# EAGLE design HealthMonitor (EAGLE 9.5.0)
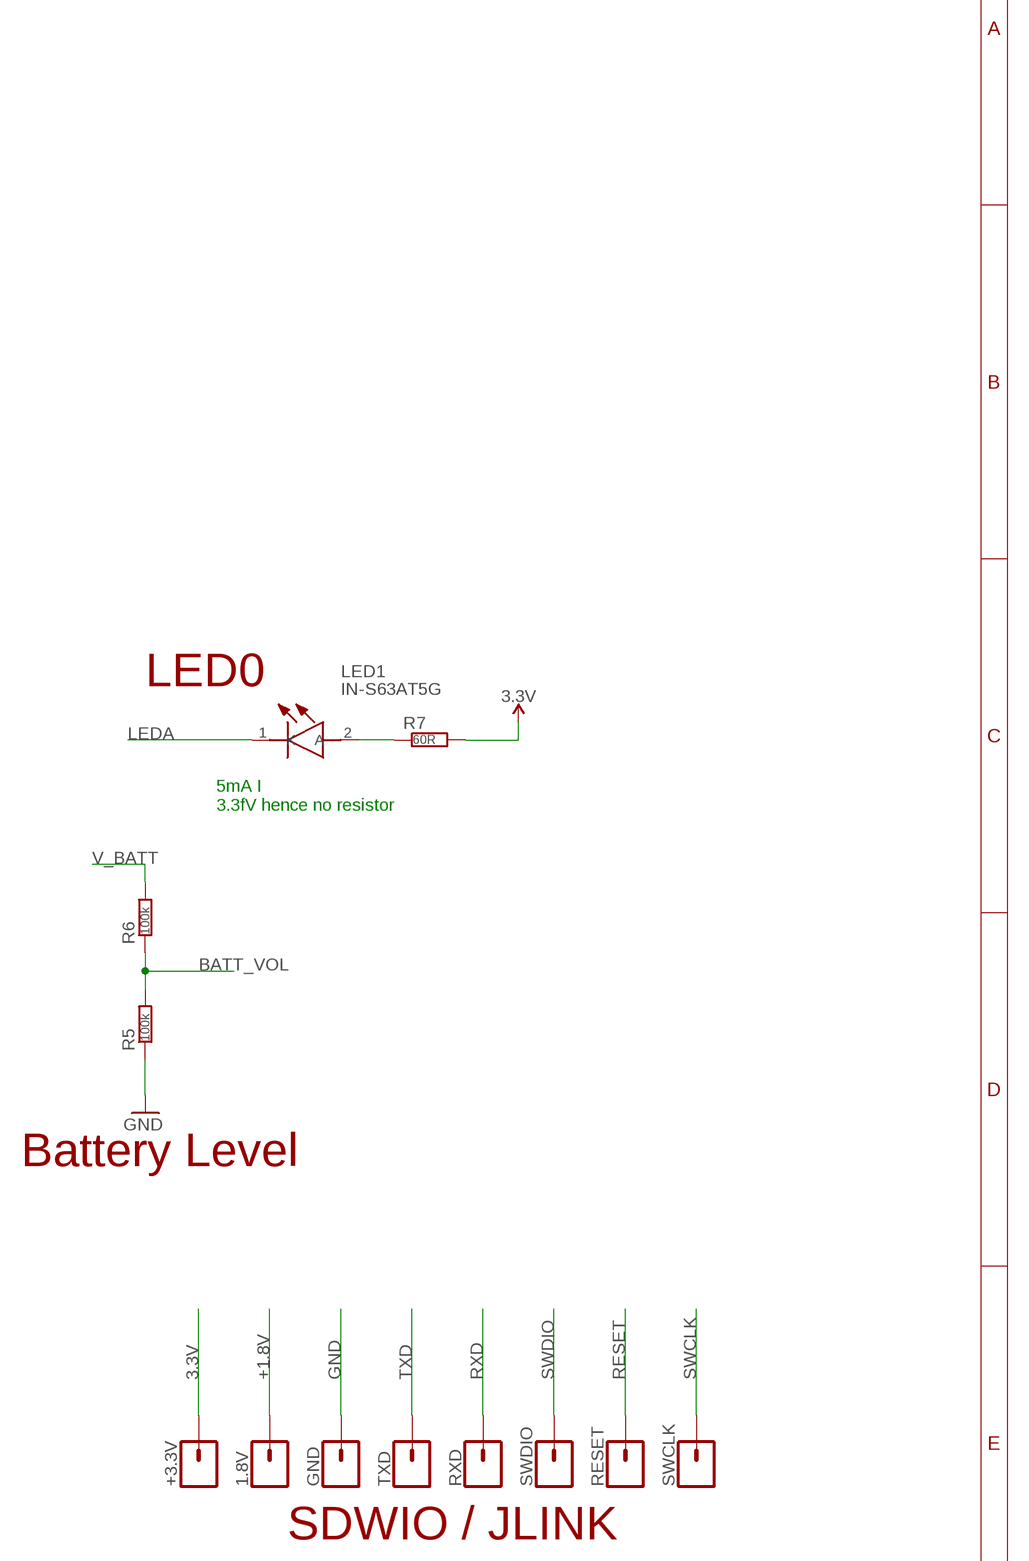
[diagram p0: schematic, sheet 1, part 1 of 2]
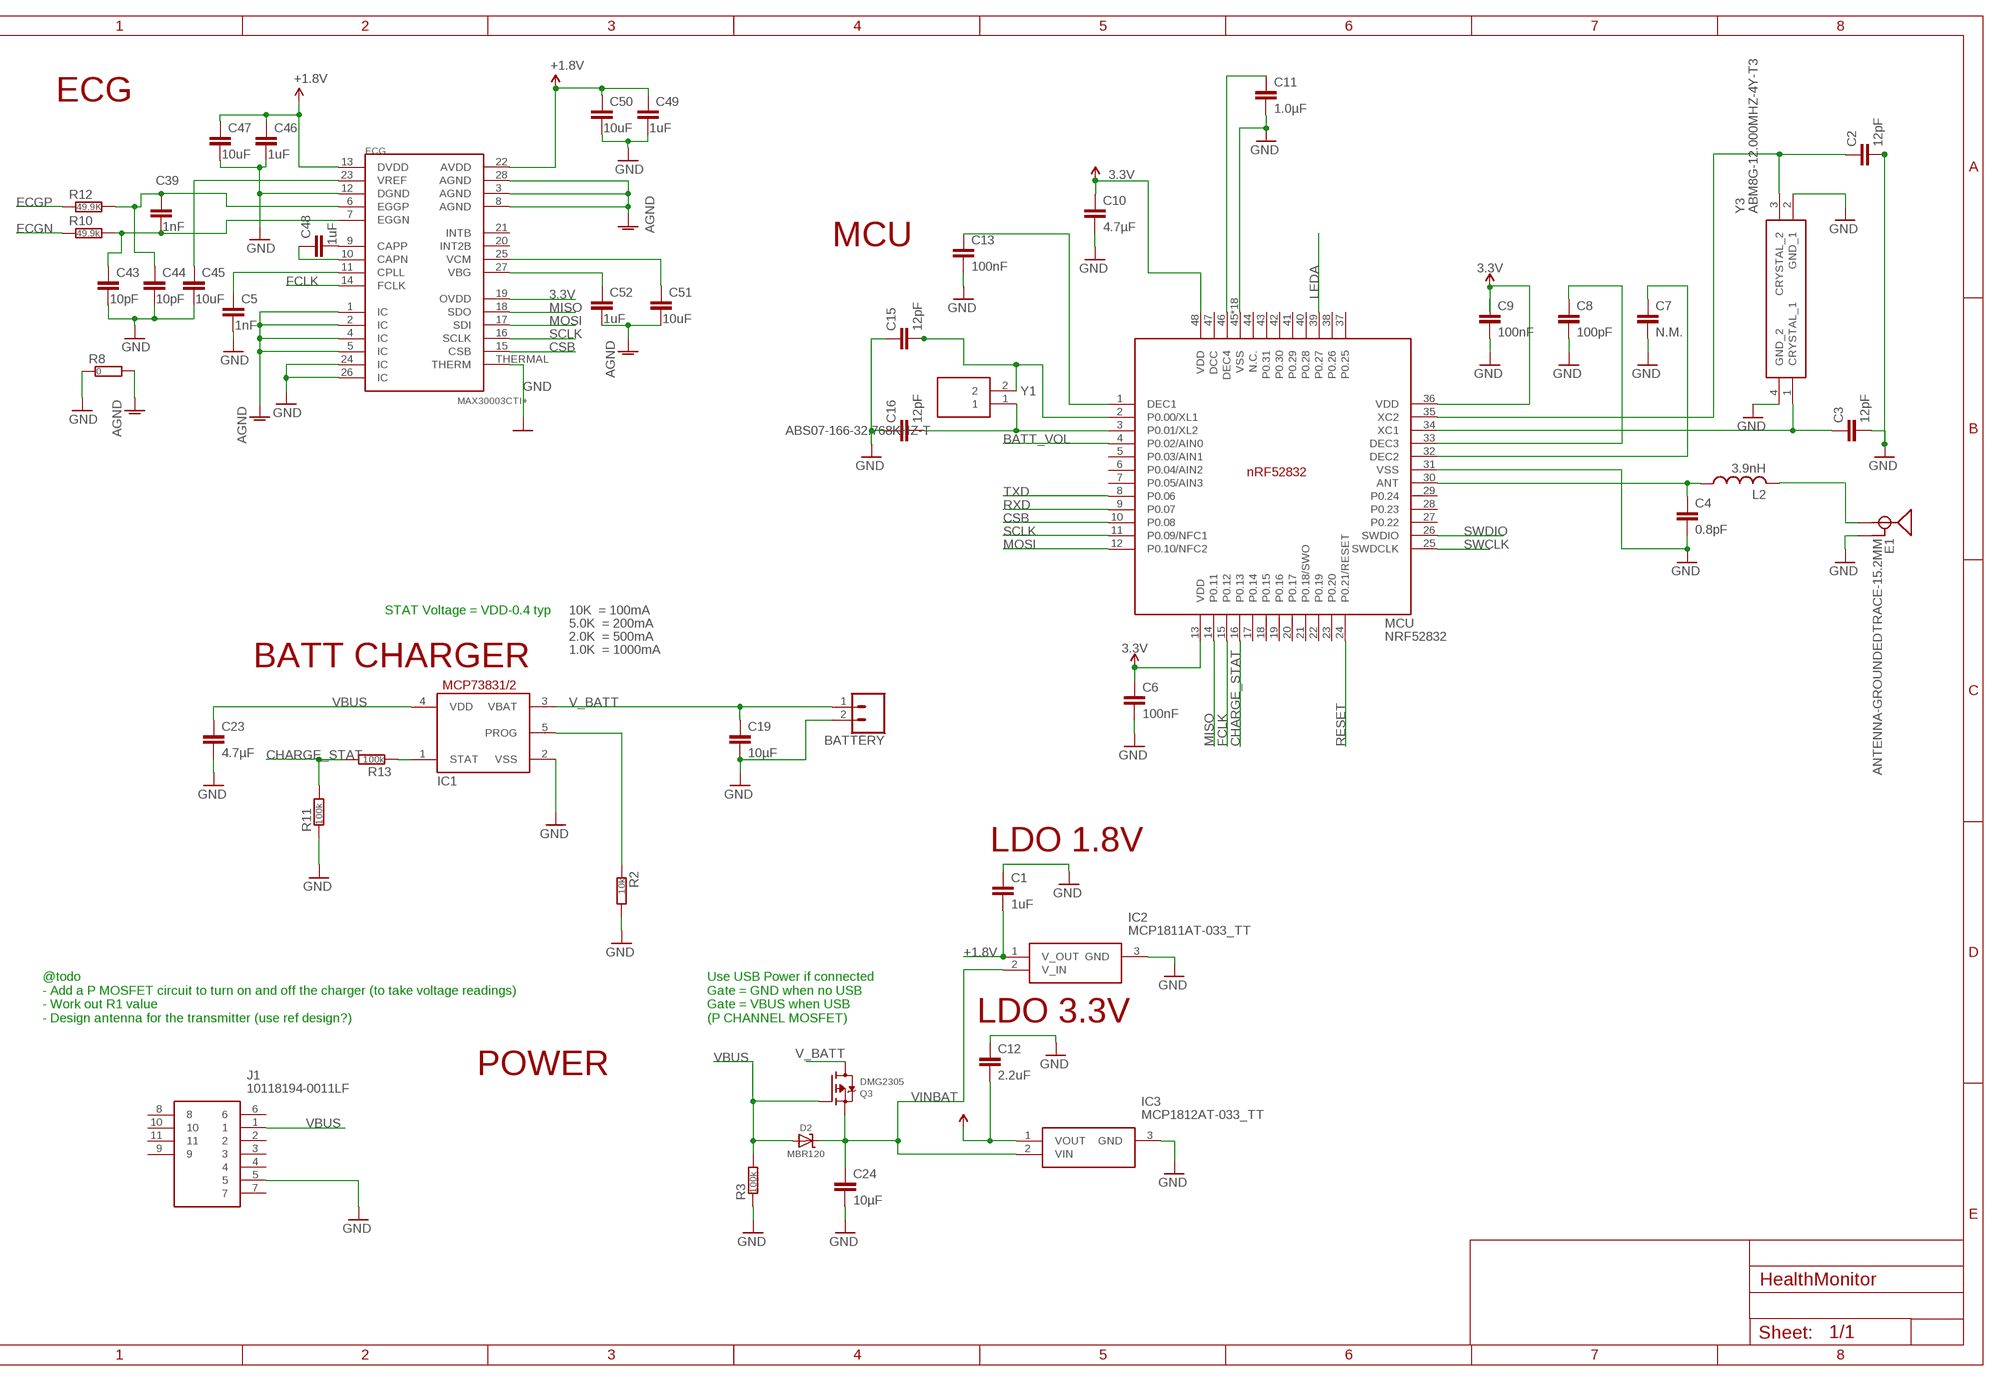
[diagram p1: schematic, sheet 1, part 2 of 2]

## Parts
1.8V  CONN_01  [1X01]
+3.3V  CONN_01  [1X01]
BATTERY  CONN_02  [1X02]
C1  1uF  CAPACITOR_0603_N  [RESC0603_N]
C2  12pF  CAPACITOR_0603_N  [RESC0603_N]
C3  12pF  CAPACITOR_0603_N  [RESC0603_N]
C4  0.8pF  CAPACITOR_0603_N  [RESC0603_N]
C5  1nF  CAPACITOR_0603_N  [RESC0603_N]
C6  100nF  CAPACITOR_0603_N  [RESC0603_N]
C7  N.M.  CAPACITOR_0603_N  [RESC0603_N]
C8  100pF  CAPACITOR_0603_N  [RESC0603_N]
C9  100nF  CAPACITOR_0603_N  [RESC0603_N]
C10  4.7µF  CAPACITOR_0603_N  [RESC0603_N]
C11  1.0µF  CAPACITOR_0603_N  [RESC0603_N]
C12  2.2uF  CAPACITOR_0603_N  [RESC0603_N]
C13  100nF  CAPACITOR_0603_N  [RESC0603_N]
C15  12pF  CAPACITOR_0603_N  [RESC0603_N]
C16  12pF  CAPACITOR_0603_N  [RESC0603_N]
C19  10µF  CAPACITOR_0603_N  [RESC0603_N]
C23  4.7µF  CAPACITOR_0603_N  [RESC0603_N]
C24  10µF  CAPACITOR_0603_N  [RESC0603_N]
C39  1nF  CAPACITOR_0603_N  [RESC0603_N]
C43  10pF  CAPACITOR_0603_N  [RESC0603_N]
C44  10pF  CAPACITOR_0603_N  [RESC0603_N]
C45  10uF  CAPACITOR_0603_N  [RESC0603_N]
C46  1uF  CAPACITOR_0603_N  [RESC0603_N]
C47  10uF  CAPACITOR_0603_N  [RESC0603_N]
C48  1uF  CAPACITOR_0603_N  [RESC0603_N]
C49  1uF  CAPACITOR_0603_N  [RESC0603_N]
C50  10uF  CAPACITOR_0603_N  [RESC0603_N]
C51  10uF  CAPACITOR_0603_N  [RESC0603_N]
C52  1uF  CAPACITOR_0603_N  [RESC0603_N]
D2  MBR120  DIODE-SCHOTTKYSOD-123  [SOD-123]
E1  ANTENNA-GROUNDEDTRACE-15.2MM  [TRACE_ANTENNA_2.4GHZ_15.2MM]
ECG  MAX30003CTI+  MAX30003  [QFN-28]
GND  CONN_01  [1X01]
IC1  MCP73831/OT  [SOT23-5L]
IC2  MCP1811AT-033_TT  [SOT95P237X112-3N@1]
IC3  MCP1812AT-033_TT  [SOT95P237X112-3N]
J1  10118194-0011LF  [101181940011LF]
L2  3.9nH  INDUCTOR_0603_N  [RESC0603_N]
LED1  IN-S63AT5G  [LEDM168X39N]
MCU  NRF52832  [QFN40P600X600X90-48_N]
Q3  DMG2305  MOSFET-P  [SOT23-R]
R2  10k  RESISTOR_0603_N  [RESC0603_N]
R3  100k  RESISTOR_0603_N  [RESC0603_N]
R5  100k  RESISTOR_0603_N  [RESC0603_N]
R6  100k  RESISTOR_0603_N  [RESC0603_N]
R7  60R  RESISTOR_0603_N  [RESC0603_N]
R8  0  RESISTOR_0603_N  [RESC0603_N]
R10  49.9k  RESISTOR_0603_N  [RESC0603_N]
R11  100k  RESISTOR_0603_N  [RESC0603_N]
R12  49.9K  RESISTOR_0603_N  [RESC0603_N]
R13  100k  RESISTOR_0603_N  [RESC0603_N]
RESET  CONN_01  [1X01]
RXD  CONN_01  [1X01]
SWCLK  CONN_01  [1X01]
SWDIO  CONN_01  [1X01]
TXD  CONN_01  [1X01]
Y1  ABS07-166-32.768KHZ-T  [ABS0716632768KHZT]
Y3  ABM8G-12.000MHZ-4Y-T3  [ABM8G16000MHZB4YT]

## Nets
3.3V [power]: +3.3V.1 C6.1 C9.1 C10.1 C12.2 ECG.19(OVDD) IC3.1(VOUT) MCU.13(VDD) MCU.36(VDD) MCU.48(VDD) R7.2
+1.8V [power]: 1.8V.1 C1.2 C46.1 C47.1 C49.1 C50.1 ECG.13(DVDD) ECG.22(AVDD) IC2.1(V_OUT)
AGND: C51.2 C52.2 ECG.1(IC) ECG.2(IC) ECG.3(AGND) ECG.4(IC) ECG.5(IC) ECG.8(AGND) ECG.28(AGND) R8.2
BATT_VOL: MCU.4(P0.02/AIN0) R5.2 R6.1
CHARGE_STAT: MCU.16(P0.13) R11.2 R13.2
CSB: ECG.15(CSB) MCU.10(P0.08)
ECGN: R10.1
ECGN1: C39.2 C43.1 ECG.7(EGGN) R10.2
ECGP: R12.1
ECGP1: C39.1 C44.1 ECG.6(EGGP) R12.2
FCLK: ECG.14(FCLK) MCU.15(P0.12)
GND [power]: BATTERY.2 C1.1 C2.2 C3.2 C4.2 C5.2 C6.2 C7.2 C8.2 C9.2 C10.2 C11.2 C12.1 C13.2 C15.1 C16.1 C19.2 C23.2 C24.2 C43.2 C44.2 C45.2 C46.2 C47.2 C49.2 C50.2 E1.GND ECG.12(DGND) ECG.24(IC) ECG.26(IC) ECG.THERMAL(THERM) GND.1 IC1.2(VSS) IC2.3(GND) IC3.3(GND) J1.5 MCU.31(VSS) MCU.45(VSS) MCU.PAD(VSS) MCU.PAD@VIA01(VSS) MCU.PAD@VIA02(VSS) MCU.PAD@VIA03(VSS) MCU.PAD@VIA04(VSS) MCU.PAD@VIA05(VSS) MCU.PAD@VIA06(VSS) MCU.PAD@VIA07(VSS) MCU.PAD@VIA08(VSS) MCU.PAD@VIA09(VSS) MCU.PAD@VIA10(VSS) MCU.PAD@VIA11(VSS) MCU.PAD@VIA12(VSS) MCU.PAD@VIA13(VSS) MCU.PAD@VIA14(VSS) MCU.PAD@VIA15(VSS) MCU.PAD@VIA16(VSS) R2.2 R3.1 R5.1 R8.1 R11.1 Y3.2(GND_1) Y3.4(GND_2)
LEDA: LED1.1(K) MCU.39(P0.27)
MISO: ECG.18(SDO) MCU.14(P0.11)
MOSI: ECG.17(SDI) MCU.12(P0.10/NFC2)
N$1: IC1.5(PROG) R2.1
N$2: IC1.1(STAT) R13.1
N$4: C13.1 MCU.1(DEC1)
N$5: LED1.2(A) R7.1
N$7: C11.1 MCU.46(DEC4)
N$9: C51.1 ECG.25(VCM)
N$13: C16.2 MCU.3(P0.01/XL2) Y1.1
N$14: C3.1 MCU.34(XC1) Y3.1(CRYSTAL_1)
N$15: C4.1 L2.1 MCU.30(ANT)
N$16: E1.ANT(SIGNAL) L2.2
N$17: C5.1 ECG.11(CPLL)
N$18: C48.1 ECG.10(CAPN)
N$19: C45.1 ECG.23(VREF)
N$20: C52.1 ECG.27(VBG)
N$22: C7.1 MCU.32(DEC2)
N$23: C48.2 ECG.9(CAPP)
N$25: C2.1 MCU.35(XC2) Y3.3(CRYSTAL_2)
N$29: C8.1 MCU.33(DEC3)
RESET: MCU.24(P0.21/RESET) RESET.1
RXD: MCU.9(P0.07) RXD.1
SCLK: ECG.16(SCLK) MCU.11(P0.09/NFC1)
SWCLK: MCU.25(SWDCLK) SWCLK.1
SWDIO: MCU.26(SWDIO) SWDIO.1
TXD: MCU.8(P0.06) TXD.1
V_BATT [power]: BATTERY.1 C19.1 IC1.3(VBAT) Q3.3(D) R6.2
VBUS [power]: C23.1 D2.A IC1.4(VDD) J1.1 Q3.1(G) R3.2
VINBAT [power]: C24.1 D2.C IC2.2(V_IN) IC3.2(VIN) Q3.2(S)
XL1: C15.2 MCU.2(P0.00/XL1) Y1.2
Unconnected: ECG.20(INT2B) ECG.21(INTB) J1.2 J1.3 J1.4 J1.6 J1.7 J1.8 J1.9 J1.10 J1.11 MCU.5(P0.03/AIN1) MCU.6(P0.04/AIN2) MCU.7(P0.05/AIN3) MCU.17(P0.14) MCU.18(P0.15) MCU.19(P0.16) MCU.20(P0.17) MCU.21(P0.18/SWO) MCU.22(P0.19) MCU.23(P0.20) MCU.27(P0.22) MCU.28(P0.23) MCU.29(P0.24) MCU.37(P0.25) MCU.38(P0.26) MCU.40(P0.28) MCU.41(P0.29) MCU.42(P0.30) MCU.43(P0.31) MCU.44(N.C.) MCU.47(DCC)

## Notes on the sheet
- ECG
- MCU
- STAT Voltage = VDD-0.4 typ | 10K  = 100mA
- 5.0K  = 200mA
- 2.0K  = 500mA
- LED0 | 1.0K  = 1000mA
- BATT CHARGER
- 5mA I
  3.3fV hence no resistor
- LDO 1.8V
- Battery Level
- @todo 
  - Add a P MOSFET circuit to turn on and off the charger (to take voltage readings) 
  - Work out R1 value 
  - Design antenna for the transmitter (use ref design?)
- Use USB Power if connected
  Gate = GND when no USB 
  Gate = VBUS when USB 
  (P CHANNEL MOSFET)
- LDO 3.3V
- POWER
- SDWIO / JLINK

## Library data of the parts
1.8V +3.3V GND RESET RXD SWCLK SWDIO TXD = SparkFun-Connectors:CONN_01: Single connection point. Often used as Generic Header-pin footprint for 0.1 inch spaced/style header connections On any of the 0.1 inch spaced packages, you can populate with these: Break Away Headers - Straight <https://www.sparkfun.com/products/116> (PRT-00116) Break Away Male Headers - Right Angle <https://www.sparkfun.com/products/553> (PRT-00553) Female Headers <https://www.sparkfun.com/products/115> (PRT-00115) Break Away Headers - Machine Pin <https://www.sparkfun.com/products/117> (PRT-00117) Break Away Female Headers - Swiss Machine Pin <https://www.sparkfun.com/products/743> (PRT-00743) This device is also useful as a general connection point to wire up your design to another part of your project. Our various solder wires solder well into these plated through hole pads. Hook-Up Wire - Assortment (Stranded, 22 AWG) <https://www.sparkfun.com/products/11375> (PRT-11375) Hook-Up Wire - Assortment (Solid Core, 22 AWG) <https://www.sparkfun.com/products/11367> (PRT-11367) View the entire wire category on our website here <https://www.sparkfun.com/categories/141> Special notes: SMTSO-256-ET is a "flush mount" nut for a 4-40 screw. We mostly use this on specialty testbeds; it is a nice way to connect hardware to your PCB at an adjustable hieght. Also note, the SNAP packages are for using a snappable style connector. We sell a baggie of snaps and they are also used on two LilyPad designs: Snap Assortment - 30 pack (male and female) <https://www.sparkfun.com/products/11347> (DEV-11347) LilyPad Arduino SimpleSnap <https://www.sparkfun.com/products/10941> (DEV-10941) LilyPad SimpleSnap Protoboard <https://www.sparkfun.com/products/10940> (DEV-10940)
BATTERY = SparkFun-Connectors:CONN_02: Multi connection point. Often used as Generic Header-pin footprint for 0.1 inch spaced/style header connections On any of the 0.1 inch spaced packages, you can populate with these: Break Away Headers - Straight <https://www.sparkfun.com/products/116> (PRT-00116) Break Away Male Headers - Right Angle <https://www.sparkfun.com/products/553> (PRT-00553) Female Headers <https://www.sparkfun.com/products/115> (PRT-00115) Break Away Headers - Machine Pin <https://www.sparkfun.com/products/117> (PRT-00117) Break Away Female Headers - Swiss Machine Pin <https://www.sparkfun.com/products/743> (PRT-00743) For SCREWTERMINALS and SPRING TERMINALS visit here: Screw Terimnals on SparkFun.com <https://www.sparkfun.com/search/results?term=Screw+Terminals> (5mm/3.5mm/2.54mm spacing) This device is also useful as a general connection point to wire up your design to another part of your project. Our various solder wires solder well into these plated through hole pads. Hook-Up Wire - Assortment (Stranded, 22 AWG) <https://www.sparkfun.com/products/11375> (PRT-11375) Hook-Up Wire - Assortment (Solid Core, 22 AWG) <https://www.sparkfun.com/products/11367> (PRT-11367) View the entire wire category on our website here <https://www.sparkfun.com/categories/141> Special notes: Molex polarized connector foot print use with: PRT-08233 with associated crimp pins and housings. 2.54_SCREWTERM for use with PRT-10571. 3.5mm Screw Terminal footprints for PRT-08084 5mm Screw Terminal footprints for use with PRT-08432
C1-C13 C15 C16 C19 C23 C24 C39 C43-C52 = Nordic_nRF:CAPACITOR: Generic chip capacitor
D2 = microbuilder:DIODE-SCHOTTKY
E1 = SparkFun-RF:ANTENNA-GROUNDED: Antenna w/ Ground Connection 2.4GHz antennae with signal and ground terminals. TRACE_ANTENNA_2.4GHZ_15.2MM - Meander Trace antenna 15.2 x 5.7mm footprint Based on layout from TI app note AN043 <http://www.ti.com/lit/an/swra117d/swra117d.pdf>. TRACE_ANTENNA_2.4GHZ_25.7MM - Inverted F trace antenna 25.7 x 7.5 mm footprint. Based on layout from TI design note DN0007 <http://www.ti.com/lit/an/swru120b/swru120b.pdf>.
ECG = circuitects:MAX30003
IC1 = adafruit:MCP73831: MCP73831/2 Miniature Single-Cell, Fully Integrated Li-Ion, Li-Polymer Charge Management Controllers. Nice and small simple lipoly charge controller, with adjustable current and status output (LED) http://www.ladyada.net/library/pcb/eaglelibrary.html
IC2 = SamacSys_Parts:MCP1811AT-033_TT: LDO Voltage Regulators Ultra Low Iq LDO Source: Datasheet <https://componentsearchengine.com/Datasheets/1/MCP1811AT-033_TT.pdf>; DESCRIPTION: LDO Voltage Regulators Ultra Low Iq LDO; HEIGHT: 1.12mm; MANUFACTURER_NAME: Microchip; MANUFACTURER_PART_NUMBER: MCP1811AT-033/TT; MOUSER_PART_NUMBER: 579-MCP1811AT-033/TT; MOUSER_PRICE-STOCK: https://www.mouser.com/Search/Refine.aspx?Keyword=579-MCP1811AT-033%2FTT
IC3 = SamacSys_Parts:MCP1812AT-033_TT: MICROCHIP - MCP1812AT-033/TT - LDO, FIXED, 3.3V, 0.3A, -40 TO 85DEG C Source: Datasheet <http://ww1.microchip.com/downloads/en/DeviceDoc/MCP1811A-11B-12A-12B-Data-Sheet-20006088B.pdf>; DESCRIPTION: MICROCHIP - MCP1812AT-033/TT - LDO, FIXED, 3.3V, 0.3A, -40 TO 85DEG C; HEIGHT: 1.12mm; MANUFACTURER_NAME: Microchip; MANUFACTURER_PART_NUMBER: MCP1812AT-033/TT; MOUSER_PART_NUMBER: 579-MCP1812AT-033/TT; MOUSER_PRICE-STOCK: https://www.mouser.com/Search/Refine.aspx?Keyword=579-MCP1812AT-033%2FTT
J1 = SamacSys_Parts:10118194-0011LF: Power to the Board MICRO USD B-TYPE Source: Datasheet <https://cdn.amphenol-icc.com/media/wysiwyg/files/drawing/10118194.pdf>; DESCRIPTION: Power to the Board MICRO USD B-TYPE; HEIGHT: 2mm; MANUFACTURER_NAME: Amphenol; MANUFACTURER_PART_NUMBER: 10118194-0011LF; MOUSER_PART_NUMBER: 649-10118194-0011LF; MOUSER_PRICE-STOCK: https://www.mouser.com/Search/Refine.aspx?Keyword=649-10118194-0011LF
L2 = Nordic_nRF:INDUCTOR: Generic chip inductor
LED1 = SamacSys_Parts:IN-S63AT5G: Standard LEDs - SMD True Green LED Source: Datasheet <http://www.inolux-corp.com/datasheet/SMDLED/Mono Color Top View/IN-S63AT Series_V1.1.pdf>; DESCRIPTION: Standard LEDs - SMD True Green LED; HEIGHT: 0.39mm; MANUFACTURER_NAME: Inolux; MANUFACTURER_PART_NUMBER: IN-S63AT5G; MOUSER_PART_NUMBER: 743-IN-S63AT5G; MOUSER_PRICE-STOCK: https://www.mouser.com/Search/Refine.aspx?Keyword=743-IN-S63AT5G
MCU = Nordic_nRFMAV:NRF52832: nRF52832 Features Single chip, highly flexible, 2.4 GHz multi-protocol SoC 32-bit ARM Cortex-M4F Processor 1.7v to 3.6v operation 512kB flash + 64kB RAM Supports concurrent Bluetooth Smart/ANT protocol operation On-chip NFC tag for Out-of-Band (OOB) pairing Up to +4dBm output power -96dBm sensitivity, Bluetooth Smart Thread safe and run-time protected Event driven API On air compatible with nRF24L and nRF24AP series 2 data rates (2Mbps/1Mbps) PPI - maximum flexibility for power-efficient applications and code simplification Automated power management system with automatic power management of each peripheral Configurable I/O mapping for analog and digital I/O 3 x Master/Slave SPI 2 x Two-wire interface (I²C) UART (RTS/CTS) 3 x PWM AES HW encryption Real Time Counter (RTC) Digital microphone interface (PDM) On-chip balun Applications Internet of Things (IoT) Wearables SmartHome sensors Connected white goods Computer peripherals Voice-command smart remotes A4WP ‘Rezence’ wireless charging Beacons Sports and fitness sensors and hubs Connected health products Smart watches RC Toys Interactive games Building automation and sensor networks
Q3 = microbuilder:MOSFET-P: P-Channel Mosfet LEGEND VDS: Voltage Drain-Source ID: Drain Current RDS(ON): Drain-Source On-State Resistance VGS(TH): Gate-Source Threshold Voltage CISS: Drain-Source Input Capacitance SOT-23 Name VDS ID RDS(ON) VGS(TH) CISS Order Number IRLML5103 30V 760mA 600 mOhm -- 75pF @ 25V Digikey: IRLML5103PBFCT-ND IRLML6401 12V 4.3A 50 mOhm 950mV @ 250µA 830pF @ 10V Digikey: IRLML6401PBFTR-ND NTR0202PL 20V 400mA 800 mOhm 2.3V @ 250uA 70pF @ 5V Digikey: NTR0202PLT1GOSTR-ND NTR4101PT1G 20V 1.8A 85 mOhm 1.2V @ 250uA 675pF @ 10V Digikey: NTR4101PT1GOSCT-ND DMP2004K 20V 600mA 900 mOhm 1V @ 250uA 175pF @ 16V Digikey: DMP2004KDICT-ND PMV65XP 20V 3.9A 76 mOhm 950mV @ 1mA 725pF @ 20V Digikey: 568-2358-2-ND TO-252 Name VDS ID RDS(ON) VGS(TH) CISS Order Number AOD417 30V 25A 34 mOhm 3V @ 250µA 920pF @ 15V Digikey: 785-1106-2-ND PowerPak Name VDS ID RDS(ON) VGS(TH) CISS Order Number AON7401 30V 12A 14 mOhm 3V @ 250µA 2600pF @ 15V Digikey: 785-1302-1-ND
R2 R3 R5-R8 R10-R13 = Nordic_misc:RESISTOR: Generic chip resistor
Y1 = SamacSys_Parts:ABS07-166-32.768KHZ-T: Crystal IOT 32.786KHz XTAL 10ppm Source: Datasheet <https://abracon.com/datasheets/ABS07-166-32.768kHz-T.pdf>; DESCRIPTION: Crystal IOT 32.786KHz XTAL 10ppm; HEIGHT: 0.9mm; MANUFACTURER_NAME: ABRACON; MANUFACTURER_PART_NUMBER: ABS07-166-32.768KHZ-T; MOUSER_PART_NUMBER: 815-ABS0716632.768KT; MOUSER_PRICE-STOCK: https://www.mouser.com/Search/Refine.aspx?Keyword=815-ABS0716632.768KT; RS_PART_NUMBER: 1753474P; RS_PRICE-STOCK: http://uk.rs-online.com/web/p/products/1753474P
Y3 = SamacSys_Parts:ABM8G-12.000MHZ-4Y-T3: Abracon 12MHz Crystal Unit +/-30ppm SMD 4-Pin 3.2 x 2.5 x 1mm Source: Datasheet <https://abracon.com/Support/PackageDrawing/Resonators/ABM8G.PDF>; ALLIED_NUMBER: 71528098; ALLIED_PRICE-STOCK: https://www.alliedelec.com/abracon-abm8g-12-000mhz-4y-t3/71528098/; DESCRIPTION: Abracon 12MHz Crystal Unit +/-30ppm SMD 4-Pin 3.2 x 2.5 x 1mm; HEIGHT: 1mm; MANUFACTURER_NAME: ABRACON; MANUFACTURER_PART_NUMBER: ABM8G-12.000MHZ-4Y-T3; MOUSER_PART_NUMBER: 815-ABM8G-12-4YT3; MOUSER_PRICE-STOCK: https://www.mouser.com/Search/Refine.aspx?Keyword=815-ABM8G-12-4YT3; RS_PART_NUMBER: 1712832P; RS_PRICE-STOCK: http://uk.rs-online.com/web/p/products/1712832P

## Net classes
1 power: width 0.178 mm

## Board
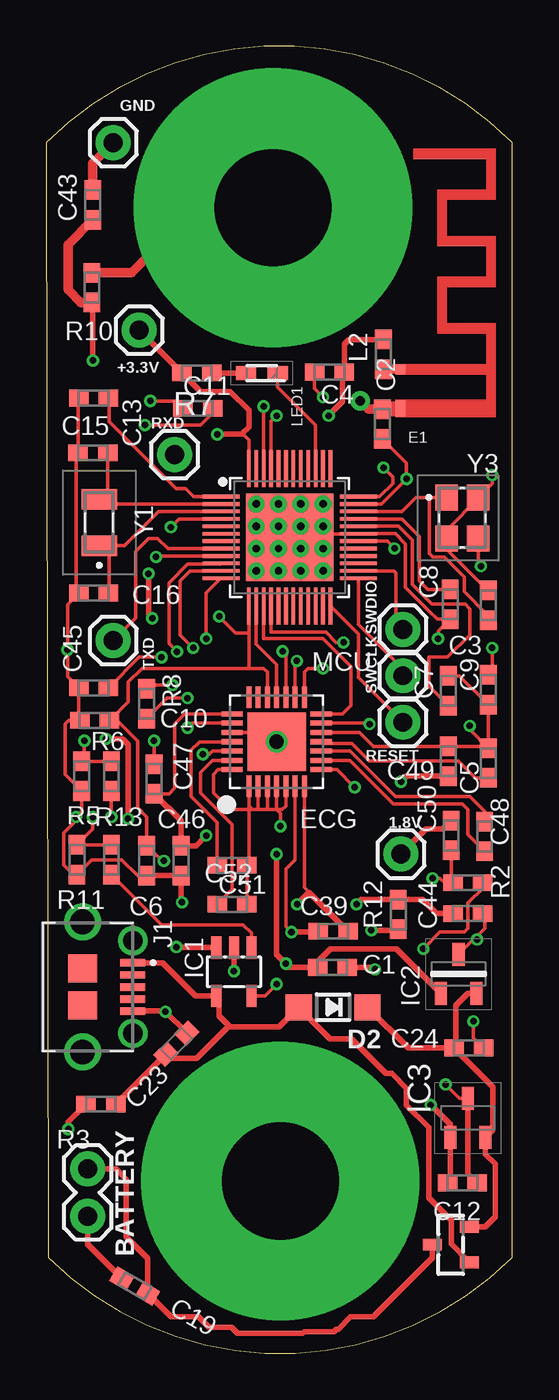
[diagram p2: board, top side]
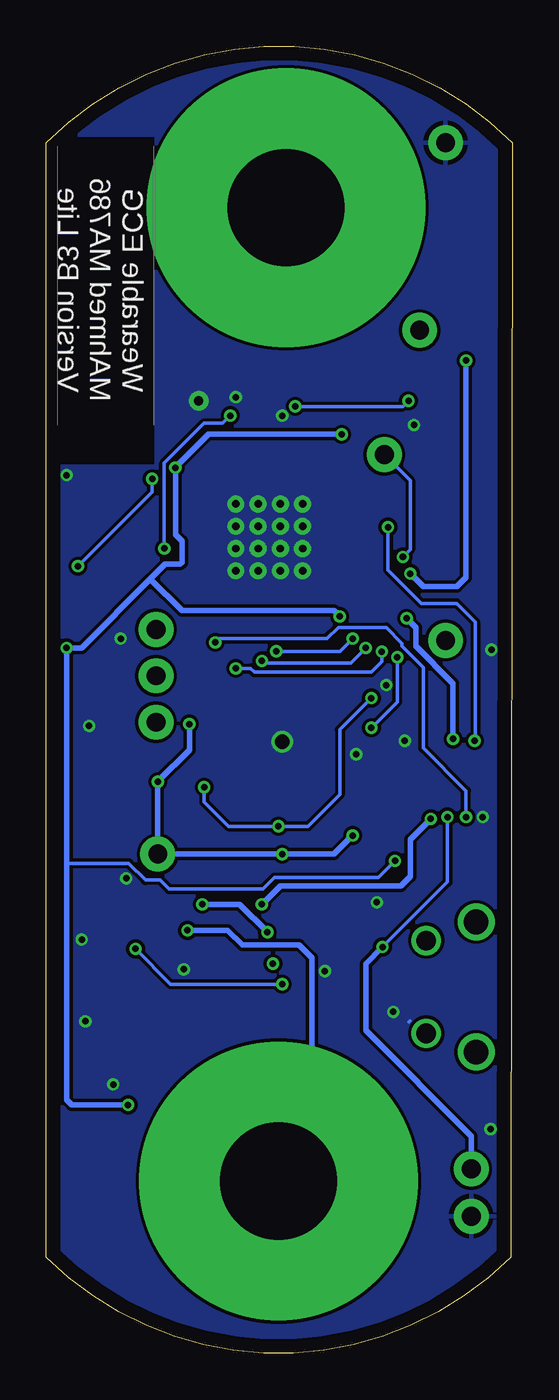
[diagram p3: board, bottom side, seen from below]

Size 25.1 x 70.34 mm. Coordinates in mm from the lower left corner, seen from the top.
Outline: 0,65.16 0.1,5.16 arc90 25.1,5.16 25.1,65.16 arc90 0,65.16
Copper layers (1*16): Top 0.035mm / dielectric 1.5mm / Bottom 0.035mm
Design rules "default *": minimum track width 7mil, minimum drill 0.35mm, track to track 7mil, track to pad 7mil, pad to pad 7mil, via to via 7mil, smd to smd 7mil, copper to edge 30mil, drill to drill 7mil, minimum pad ring 10mil, minimum via ring 6mil, stop-mask expansion 4mil, vias tented up to drill 0mil, thermal gap 10mil
bRestrict: area 19.3,47.9 to 25.1,65.5

### Footprints (pad centres in the part's own frame; a part is rotated, then mirrored left to right if it is on the bottom)
1X01 = drill 1.016 pad 1.88: 1 0,0
1X02 = drill 1.016 pad 1.88: 1 0,0; 2 2.54,0
RESC0603_N = smd 1.05 x 0.9: 1 -0.8,0; 2 0.8,0
SOD-123 = smd 1.4 x 1.4: A 1.85,0; C -1.85,0
TRACE_ANTENNA_2.4GHZ_15.2MM = smd 0.5 x 0.5 bottom: ANT 0,-0.25 | smd 0.9 x 0.5 bottom: GND -2.1,-0.25
QFN-28 = smd 1.15 x 0.27: 1 -2.4,1.5; 2 -2.4,1; 3 -2.4,0.5; 4 -2.4,0; 5 -2.4,-0.5; 6 -2.4,-1; 7 -2.4,-1.5; 15 2.4,-1.5; 16 2.4,-1; 17 2.4,-0.5; 18 2.4,0; 19 2.4,0.5; 20 2.4,1; 21 2.4,1.5 | smd 0.27 x 1.15: 8 -1.5,-2.4; 9 -1,-2.4; 10 -0.5,-2.4; 11 0,-2.4; 12 0.5,-2.4; 13 1,-2.4; 14 1.5,-2.4; 22 1.5,2.4; 23 1,2.4; 24 0.5,2.4; 25 0,2.4; 26 -0.5,2.4; 27 -1,2.4; 28 -1.5,2.4 | smd 3.15 x 3.15: THERMAL 0,0
SOT23-5L = smd 0.55 x 1.2: 1 -0.95,-1.3; 2 0,-1.3; 3 0.95,-1.3; 4 0.95,1.3; 5 -0.95,1.3
SOT95P237X112-3N@1 = smd 1.25 x 0.65: 1 -1.05,0.95; 2 -1.05,-0.95; 3 1.05,0
SOT95P237X112-3N = smd 1.25 x 0.65: 1 -1.05,0.95; 2 -1.05,-0.95; 3 1.05,0
101181940011LF = smd 0.4 x 1.35: 1 -1.3,1.825; 2 -0.65,1.825; 3 0,1.825; 4 0.65,1.825; 5 1.3,1.825 | drill 1.055 pad 1.582: 6 -2.5,1.825; 7 2.5,1.825 | drill 1.32 pad 1.98: 8 -3.5,-0.875; 9 3.5,-0.875 | smd 1.5 x 1.55: 10 -1,-0.875; 11 1,-0.875
LEDM168X39N = smd 1.1 x 0.75: 1 -0.85,0; 2 0.85,0
QFN40P600X600X90-48_N = smd 2 x 0.2: 1 -3.7,2.2; 2 -3.7,1.8; 3 -3.7,1.4; 4 -3.7,1; 5 -3.7,0.6; 6 -3.7,0.2; 7 -3.7,-0.2; 8 -3.7,-0.6; 9 -3.7,-1; 10 -3.7,-1.4; 11 -3.7,-1.8; 12 -3.7,-2.2; 25 3.7,-2.2; 26 3.7,-1.8; 27 3.7,-1.4; 28 3.7,-1; 29 3.7,-0.6; 30 3.7,-0.2; 31 3.7,0.2; 32 3.7,0.6; 33 3.7,1; 34 3.7,1.4; 35 3.7,1.8; 36 3.7,2.2 | smd 0.2 x 2: 13 -2.2,-3.7; 14 -1.8,-3.7; 15 -1.4,-3.7; 16 -1,-3.7; 17 -0.6,-3.7; 18 -0.2,-3.7; 19 0.2,-3.7; 20 0.6,-3.7; 21 1,-3.7; 22 1.4,-3.7; 23 1.8,-3.7; 24 2.2,-3.7; 37 2.2,3.7; 38 1.8,3.7; 39 1.4,3.7; 40 1,3.7; 41 0.6,3.7; 42 0.2,3.7; 43 -0.2,3.7; 44 -0.6,3.7; 45 -1,3.7; 46 -1.4,3.7; 47 -1.8,3.7; 48 -2.2,3.7 | smd 4.7 x 4.7: PAD 0,0 | drill 0.4: PAD@VIA01 -1.8,1.8; PAD@VIA02 -1.8,0.6; PAD@VIA03 -1.8,-0.6; PAD@VIA04 -1.8,-1.8; PAD@VIA05 -0.6,1.8; PAD@VIA06 -0.6,0.6; PAD@VIA07 -0.6,-0.6; PAD@VIA08 -0.6,-1.8; PAD@VIA09 0.6,1.8; PAD@VIA10 0.6,0.6; PAD@VIA11 0.6,-0.6; PAD@VIA12 0.6,-1.8; PAD@VIA13 1.8,1.8; PAD@VIA14 1.8,0.6; PAD@VIA15 1.8,-0.6; PAD@VIA16 1.8,-1.8
SOT23-R = smd 0.635 x 1.016: 1 -0.95,-1; 2 0.95,-1; 3 0,1
ABS0716632768KHZT = smd 1.1 x 1.9: 1 -1.25,0; 2 1.25,0
ABM8G16000MHZB4YT = smd 1.4 x 1.2: 1 -1.1,-0.85; 2 1.1,-0.85; 3 1.1,0.85; 4 -1.1,0.85

### Placement (x,y rotation side)
1.8V  19.1,26.86 0 top
+3.3V  5,55.06 0 top
BATTERY  2.22,9.91 270 top
C1  15.4,20.76 180 top
C2  18.1,50.01 90 top
C3  23.8,40.26 90 top
C4  15.25,52.81 180 top
C5  23.8,31.76 90 top
C6  5.4,26.51 270 top
C7  21.65,35.66 90 top
C8  21.75,40.31 270 top
C9  23.8,35.71 270 top
C10  2.6,34.06 180 top
C11  8.15,50.86 0 top
C12  22.4,9.16 180 top
C13  2.55,51.41 180 top
C15  2.5,48.46 0 top
C16  2.55,40.91 0 top
C19  4.76,3.61 150 top
C23  7,16.66 45 top
C24  22.76,16.42 0 top
C39  15.45,22.71 0 top
C43  2.5,61.81 90 top
C44  22.7,23.66 0 top
C45  2.55,35.81 180 top
C46  7.25,26.51 270 top
C47  5.8,30.91 90 top
C48  23.6,27.81 270 top
C49  21.65,31.86 90 top
C50  21.8,27.86 270 top
C51  10,26.26 0 top
C52  10,24.16 0 top
D2  15.44,18.62 180 top
E1  19.3,52.96 90 bottom
ECG  12.4,32.91 90 top
GND  3.6,65.16 0 top
IC1  10.1,20.53 180 top
IC2  22.2,20.41 90 top
IC3  22.7,12.66 90 top
J1  2.82,19.71 270 top
L2  18.15,53.76 270 top
LED1  11.6,52.76 180 top
MCU  13.1,43.91 0 top
Q3  21.78,5.84 90 top
R2  22.7,25.32 180 top
R3  2.94,13.4 0 top
R5  1.9,31.06 90 top
R6  3.5,31.06 270 top
R7  8.1,52.76 180 top
R8  5.4,34.96 270 top
R10  2.45,57.36 270 top
R11  1.65,26.56 90 top
R12  18.95,23.61 90 top
R13  3.5,26.56 90 top
RESET  19.2,33.96 180 top
RXD  6.9,48.36 0 top
SWCLK  19.2,36.46 0 top
SWDIO  19.2,38.96 0 top
TXD  3.6,38.36 0 top
Y1  2.85,44.71 90 top
Y3  22.4,44.96 270 top

### Tracks (layer width: path | path; a pad name or v marks a point on that pad's centre or on a via)
3.3V  (via drill 0.35)
  Top 0.178: C12.2 21.75,9.31 | IC3.1 21.75,12.31 | v24.01,37.96 24.01,36.72 C9.1 | ECG.19 11.9,36.66 11.7,36.86 10.9,36.86 | 10.9,36.86 5.15,36.86 4.4,36.11 4.4,35.06 C10.1 3.8,34.06 4.9,32.96 4.9,29.36 5.4,28.86 C6.1 5.43,27.29 6.23,26.49 v6.32,26.49 | MCU.13 10.9,38.76 | 10.9,38.76 10.9,36.86 | MCU.36 17.95,46.11 18.65,46.81 18.65,47.17 v18.16,47.66 | v9.2,49.46 10.5,49.46 | 10.6,49.46 10.9,49.16 MCU.48 | v9.3,39.65 10.19,38.76 10.9,38.76
  Top 0.305: 21.75,9.31 IC3.1 | 21.75,12.31 v20.7,13.36 | +3.3V.1 R7.2 8.3,51.76 9.9,51.76 10.9,50.76 10.9,49.86 10.5,49.46 | v9.2,49.46 10.6,49.46
  Bottom 0.178: v6.32,26.49 7.22,25.59 12.82,25.59 13.44,24.98 18.5,24.98 18.98,25.46 19.76,25.46 20.66,26.36 24.01,26.36 | 23.93,37.96 v24.01,37.96 | 18.15,47.65 v18.16,47.66
  Bottom 0.305: v20.7,13.36 23.75,13.36 24.01,13.62 24.01,26.36 v24.01,37.96 | v18.16,47.66 16.36,49.46 v9.2,49.46 | 23.93,37.96 23.21,37.96 19.51,41.67 | 19.51,41.67 18.71,42.47 17.89,42.47 17.8,42.56 17.8,43.71 18.15,44.06 18.15,47.65 | 19.51,41.67 17.8,39.96 9.61,39.96 v9.3,39.65
+1.8V  (via drill 0.35)
  Top 0.178: C1.2 14.6,21.06 | C47.1 6.6,30.11 6.9,30.41 6.9,33.86 7.45,34.41 ECG.22 | ECG.13 17.35,33.91 v17.4,33.86
  Top 0.305: 14.6,21.06 15.3,21.76 18.85,21.76 IC2.1 | C47.1 7.25,28.66 C46.1 8.06,27.31 v8.61,27.86 | 1.8V.1 20.45,28.21 21.35,28.21 C50.1 | v19.1,30.76 19.4,31.06 C49.1 | C1.2 13.1,20.76 v12.9,20.96 12.4,21.46 v12.4,26.86
  Bottom 0.305: v17.4,33.86 17.4,32.46 v19.1,30.76 1.8V.1 v12.4,26.86 9.61,26.86 v8.61,27.86
AGND  (via drill 0.35)
  Top 0.178: C52.2 C51.2 10.9,26.36 ECG.1 10.9,29.46 11.1,29.26 | 11.1,29.26 11.4,29.26 | 11.4,29.26 11.9,29.26 | 11.9,29.26 12.4,29.26 | 12.4,29.26 12.7,29.26 12.9,29.46 ECG.5 | ECG.4 12.4,29.26 | ECG.3 11.9,29.26 | ECG.2 11.4,29.26 | ECG.28 9.25,31.41 9,31.16 9,30.16 9.9,29.26 11.1,29.26 | ECG.8 15.65,31.41 v16.6,30.46 | v12.6,28.36 12.6,29.06 12.4,29.26 | R8.2 6.5,35.26 v7.6,35.26
  Bottom 0.178: v16.6,30.46 16.6,29.66 15.3,28.36 v12.6,28.36 11,28.36 9.3,30.06 9.3,33.56 v7.6,35.26
BATT_VOL  (via drill 0.35)
  Top 0.178: R6.1 R5.2 2.04,32 v2.04,32.96 | MCU.4 7.15,44.91 v6.7,44.46
  Bottom 0.178: v6.7,44.46 6.7,42.16 4.9,40.36 3,40.36 2,39.36 2,33 v2.04,32.96
CHARGE_STAT  (via drill 0.35)
  Top 0.178: R13.2 R11.2 2.5,28.21 v2.5,28.86 | v16,38.26 15.6,38.26 15.05,38.81 12.1,38.81 MCU.16
  Bottom 0.178: v16,38.26 15.8,38.46 9.98,38.46 9.38,39.06 6.8,39.06 5.95,38.21 5.95,38.05 4.81,36.9 4.81,32.56 2.5,30.26 v2.5,28.86
CSB  (via drill 0.35)
  Top 0.178: ECG.15 13.9,36.66 14.1,36.86 v14.9,36.86 | v7.03,37.76 6.6,38.19 6.6,41.46 7.61,42.48 9.37,42.48 MCU.10
  Bottom 0.178: v14.9,36.86 14.1,36.86 13.9,36.66 7.6,36.66 7.03,37.23 v7.03,37.76
ECGN  (via drill 6.3 pad 15)
  Top 0.508: R10.1 4.6,58.16 8.1,61.66 v12.2,61.66
ECGN1  (via drill 0.35)
  Top 0.178: 14.15,24.81 13.9,25.06 ECG.7 | 2.5,56.54 R10.2
  Top 0.305: C39.2 14.15,24.81 v13.5,24.16 | v2.5,53.43 2.5,56.54 | v5.5,41.96 5.5,39.76 v5.7,39.56 | v3.2,33.06 4.1,33.06 4.4,32.76 v4.4,28.76
  Top 0.508: C43.1 1.16,59.67 1.16,57.25 1.85,56.56 R10.2
  Bottom 0.305: v2.5,53.43 2.5,41.76 3,41.26 4.8,41.26 v5.5,41.96 | v5.7,39.56 5.21,39.07 5.21,38.06 3.2,36.05 v3.2,33.06 | v4.4,28.76 5.5,27.66 5.5,25.66 6,25.16 12.5,25.16 v13.5,24.16
ECGP  (via drill 0.35, 6.3 pad 15)
  Top 0.178: 18.9,22.76 R12.1
  Top 0.305: v17.5,22.76 18.9,22.76
  Bottom 0.305: v12.6,9.26 12.4,9.26 10.8,10.86 10.8,21.26 11.51,21.96 14.55,21.96 15.34,22.76 v17.5,22.76
ECGP1  (via drill 0.35)
  Top 0.178: C39.1 14.6,22.66 | ECG.6 13.4,26.56 12.9,26.06 12.9,22.96 v13.2,22.66
  Top 0.305: C44.1 21,23.66 20.25,24.41 R12.2 16.95,24.41 v16.7,24.16 | 14.6,22.66 v13.2,22.66
  Bottom 0.305: v13.2,22.66 14.7,24.16 v16.7,24.16
FCLK
  Top 0.178: ECG.14 15.95,34.41 16.4,34.86 16.4,36.96 14.9,38.46 11.7,38.46 MCU.15
GND  (via drill 0.35, 0.5 pad 1.05, 0.76)
  Top 0.178: 21.9,25.26 R2.2 | R2.2 21.8,25.42 C50.2 | 1.65,25.56 R11.1 2.45,26.56 3,26.56 3.01,26.55 4.06,26.55 4.9,25.71 C6.2 | 1.65,25.56 1.65,25.31 | 6.38,18.41 v6.42,18.37 | IC3.3 22.25,13.71 v21.5,14.46 | C5.2 C9.2 22.25,36.46 C7.2 | ECG.12 16.85,33.41 17.6,32.66 C49.2 23.7,32.66 C5.2 | v8.42,32.24 8.78,32.24 8.95,32.41 ECG.26 10.06,32.45 | R8.1 5.6,35.96 v6.79,35.96 | C44.2 23.6,23.56 23.6,22.86 23.2,22.46 v23.2,22.26 23,22.26 IC2.3 22.4,21.46 | C24.2 23,16.98 v23,17.86 | 7.25,24.31 v7.3,24.26 | v5.8,32.96 C47.2 | MCU.45 12.1,50.16 v12.4,50.46 | v24.01,47.26 24.01,46.82 Y3.4 23.3,46.05 21.61,44.36 21.61,43.92 Y3.2 21.61,43.83 21.61,43.21 23.75,41.07 C3.2 | C4.2 14.45,51.91 v14.9,51.46 | R2.2 21.86,25.36 21.4,25.36 21.2,25.56 v20.8,25.56 | 10.5,33.44 10.03,33.44 ECG.24 11.9,33.41 ECG.THERMAL | C13.2 1.7,51.39 1.7,48.54 C15.1 1.61,48.45 1.61,41.07 1.7,40.99 C16.1 1.14,40.29 v1.14,37.86 1.14,36.42 C45.2 1.75,34.11 C10.2 1.2,34.06 1,33.86 1,31.16 R5.1 1.9,29.16 v1.6,28.86 1.6,28.66 0.93,27.99 0.93,26.28 1.65,25.56 | MCU.PAD@VIA14 14.95,44.45 15.3,44.1 16.72,44.1 MCU.31 18.79,44.11 19.34,43.56 19.34,41.21 20.6,39.95 20.61,39.95 21.05,39.51 C8.2 21.1,38.86 v21.1,38.46 | MCU.PAD 11.21,45.79 MCU.PAD@VIA01 | C11.2 8.95,50.61 8.3,49.96 v5.3,49.96 | C5.2 22.8,33.56 v22.8,33.76
  Top 0.305: C19.2 2.22,5.86 BATTERY.2 | R3.1 1.18,12.44 v1.18,12.06 | J1.5 6.38,18.41 | v6.42,18.37 C23.2 | C1.1 17.6,20.76 v17.7,20.66 | v10.1,20.56 IC1.2 | C6.2 C46.2 7.25,24.31 | C12.1 22.7,9.66 IC3.3
  Top 0.508: C43.2 2.5,64.06 GND.1 | 18.15,50.86 C2.2 17.35,50.81 v16.9,51.26 | E1.GND 19,50.81
  Top 0.813: 19,50.81 C2.2
  Bottom 0.178: 5.52,17.87 5.58,17.83
  other vias: 12.4,32.91
  pour Bottom (rank 6): 0.1,65.16 0.1,5.16 arc90 25.15,5.16 25.15,65.16 arc90
LEDA
  Top 0.178: MCU.39 14.5,49.96 12.45,52.01 LED1.1
MISO
  Top 0.178: MCU.14 11.3,38.16 12.4,37.06 ECG.18
MOSI  (via drill 0.35)
  Top 0.178: ECG.17 12.9,37.58 12.92,37.58 v12.72,37.78 | v8.6,38.46 8.6,40.91 MCU.12
  Bottom 0.178: v12.72,37.78 9.28,37.78 v8.6,38.46
N$1  (via drill 0.35)
  Top 0.178: IC1.5 11.77,19.23 v12.4,19.86 | v20.3,21.76 21.2,22.66 22.5,22.66 22.71,22.87 22.71,24.22 23.5,25.01 R2.1
  Bottom 0.178: v12.4,19.86 18.4,19.86 v20.3,21.76
N$2
  Top 0.178: IC1.1 11.05,22.61 10.6,23.06 6.2,23.06 R13.1
N$4
  Top 0.178: C13.1 3.39,51.39 3.39,50.14 6.99,46.54 7.5,46.54 7.93,46.11 MCU.1
N$5
  Top 0.305: LED1.2 R7.1
N$7  (via drill 0.35)
  Top 0.178: MCU.46 v11.7,50.96 | v5.6,51.26 6.95,51.26 C11.1
  Bottom 0.178: v11.7,50.96 5.9,50.96 v5.6,51.26
N$9
  Top 0.178: C51.1 9.2,28.56 7.8,29.96 7.8,32.46 8.25,32.91 ECG.25
N$13
  Top 0.178: MCU.3 6.05,45.31 4.2,43.46 Y1.1 3.39,43.39 3.39,40.99 C16.2
N$14
  Top 0.178: MCU.34 19.15,45.31 19.9,46.06 20.64,46.06 | 20.64,46.06 Y3.1 | 20.64,46.06 20.64,43.03 20.81,42.85 21.44,42.85 22.5,41.79 22.5,40.99 23.75,39.74 23.75,39.47 C3.1
N$15  (via drill 0.35)
  Top 0.178: MCU.30 18.35,43.71 v18.75,43.31 | C4.1 16.1,52.86
  Top 0.305: L2.1 16.3,54.56 16.05,54.31 C4.1 15.95,52.71 15.95,51.21 v15.2,50.46
  Bottom 0.178: v18.75,43.31 18.75,47.91 16.6,50.06 15.6,50.06 v15.2,50.46
N$16
  Top 0.508: L2.2 E1.ANT
N$17
  Top 0.178: C5.1 23.1,30.96 22.19,31.87 17.4,31.87 16.45,32.81 14.9,32.81 ECG.11
N$18
  Top 0.178: ECG.10 16.35,32.41 18.8,29.96 22.8,29.96 23.6,29.16 C48.1
N$19  (via drill 0.35)
  Top 0.178: ECG.23 7.85,33.91 v7.6,33.66 | C45.1 5,37.46 v6.2,37.46
  Bottom 0.178: v7.6,33.66 6.2,35.06 v6.2,37.46
N$20
  Top 0.178: C52.1 9.99,24.95 9.99,28.47 8.3,30.16 8.3,31.26 8.95,31.91 ECG.27
N$22
  Top 0.178: MCU.32 18.95,44.51 19.7,43.76 19.7,41.36 20.75,40.31 22.55,40.31 22.8,40.06 22.8,38.66 21.6,37.46 20.6,37.46 20.6,35.91 C7.1
N$23
  Top 0.178: C48.2 22.7,27.91 22.7,29.26 22.4,29.56 18.7,29.56 16.35,31.91 ECG.9
N$25  (via drill 0.35)
  Top 0.178: Y3.3 23.25,42.51 v23.4,42.36 | MCU.35 18.05,45.71 v19.4,47.06 19.4,47.91 C2.1
  Bottom 0.178: v23.4,42.36 19.4,46.36 v19.4,47.06
N$29
  Top 0.178: MCU.33 19.15,44.91 20.1,43.96 20.1,41.56 20.55,41.11 C8.1
RESET
  Top 0.178: MCU.24 16.8,38.71 16.8,36.36 RESET.1
RXD  (via drill 0.35)
  Top 0.178: v5.9,42.86 5.95,42.91 MCU.9
  Bottom 0.178: RXD.1 5.5,46.96 5.5,43.26 v5.9,42.86
SCLK  (via drill 0.35)
  Top 0.178: ECG.16 13.4,37.16 v13.49,37.26 | v7.9,37.96 7.2,38.66 7.2,41.56 7.75,42.11 MCU.11
  Bottom 0.178: v13.49,37.26 13.39,37.16 8.7,37.16 v7.9,37.96
SWCLK
  Top 0.178: MCU.25 16.81,41.7 16.81,39.21 19.12,36.9 19.12,36.54 SWCLK.1
SWDIO
  Top 0.178: MCU.26 18.71,42.11 18.83,42 18.83,39.31 SWDIO.1
TXD
  Top 0.178: MCU.8 6.55,43.31 6,43.86 5.5,43.86 4.8,43.16 4.8,39.56 TXD.1
V_BATT  (via drill 0.35)
  Top 0.178: 6.69,1.97 6.72,1.96 | 10.89,1.07 10.9,1.06 | 15.63,1.29 15.72,1.29 | 7.03,21.83 v7,21.86 | R6.2 v3.5,28.86
  Top 0.305: 6.69,1.97 C19.1 5.45,5.11 4.3,6.26 4.3,9.36 3.75,9.91 BATTERY.1 | 6.72,1.96 8.2,1.96 8.74,1.42 8.9,1.39 9.97,1.39 10.29,1.07 10.89,1.07 | 10.9,1.06 13.8,1.06 13.9,1.16 15.5,1.16 15.63,1.29 | 15.72,1.29 16.38,1.96 17.6,1.96 20.78,5.14 Q3.3 | IC1.3 7.03,21.83
  Bottom 0.178: v3.5,28.86 3.5,25.36 v7,21.86
  Bottom 0.305: v7,21.86 7.9,20.96 7.9,20.16 7.9,17.36 2.22,11.68 BATTERY.1
VBUS
  Top 0.178: IC1.4 9.3,19.08 | 9.85,17.61 9.9,17.56 | C23.1 6.67,15.86
  Top 0.305: Q3.1 21.8,5.87 21.8,7.16 20.6,8.36 20.6,12.14 19.4,13.34 19.4,14.26 18.6,15.06 18.28,15.06 16.42,16.93 15.28,16.93 D2.A 12.53,17.56 9.9,17.56 | R3.2 C23.1 | J1.1 6.25,21.01 8.03,19.23 IC1.4 | 9.3,19.08 9.3,18.16 9.85,17.61 8.1,15.86 6.67,15.86
VINBAT
  Top 0.178: C24.1 22.06,16.52
  Top 0.305: D2.C 19.49,16.42 C24.1 24.05,14.33 24.05,12.01 IC3.2 23.65,10.71 24.19,10.17 24.19,7.34 23.63,6.79 Q3.2 | 22.06,16.52 22.06,18.72 22.7,19.36 IC2.2
XL1
  Top 0.178: MCU.2 3.1,45.71 Y1.2 3.3,45.79 C15.2

### Text on the board
bPlace: Wearable ECG / MAhmed MA786 / Version B3 Lite
silk_bottom: Designed By M Ahmed / Wearable ECG Monitor / Version 1.00